# Altium schematic sheet STM32f103c8_minsystem V2_1.SchDoc
size A4; DrawnBy: 王星灿
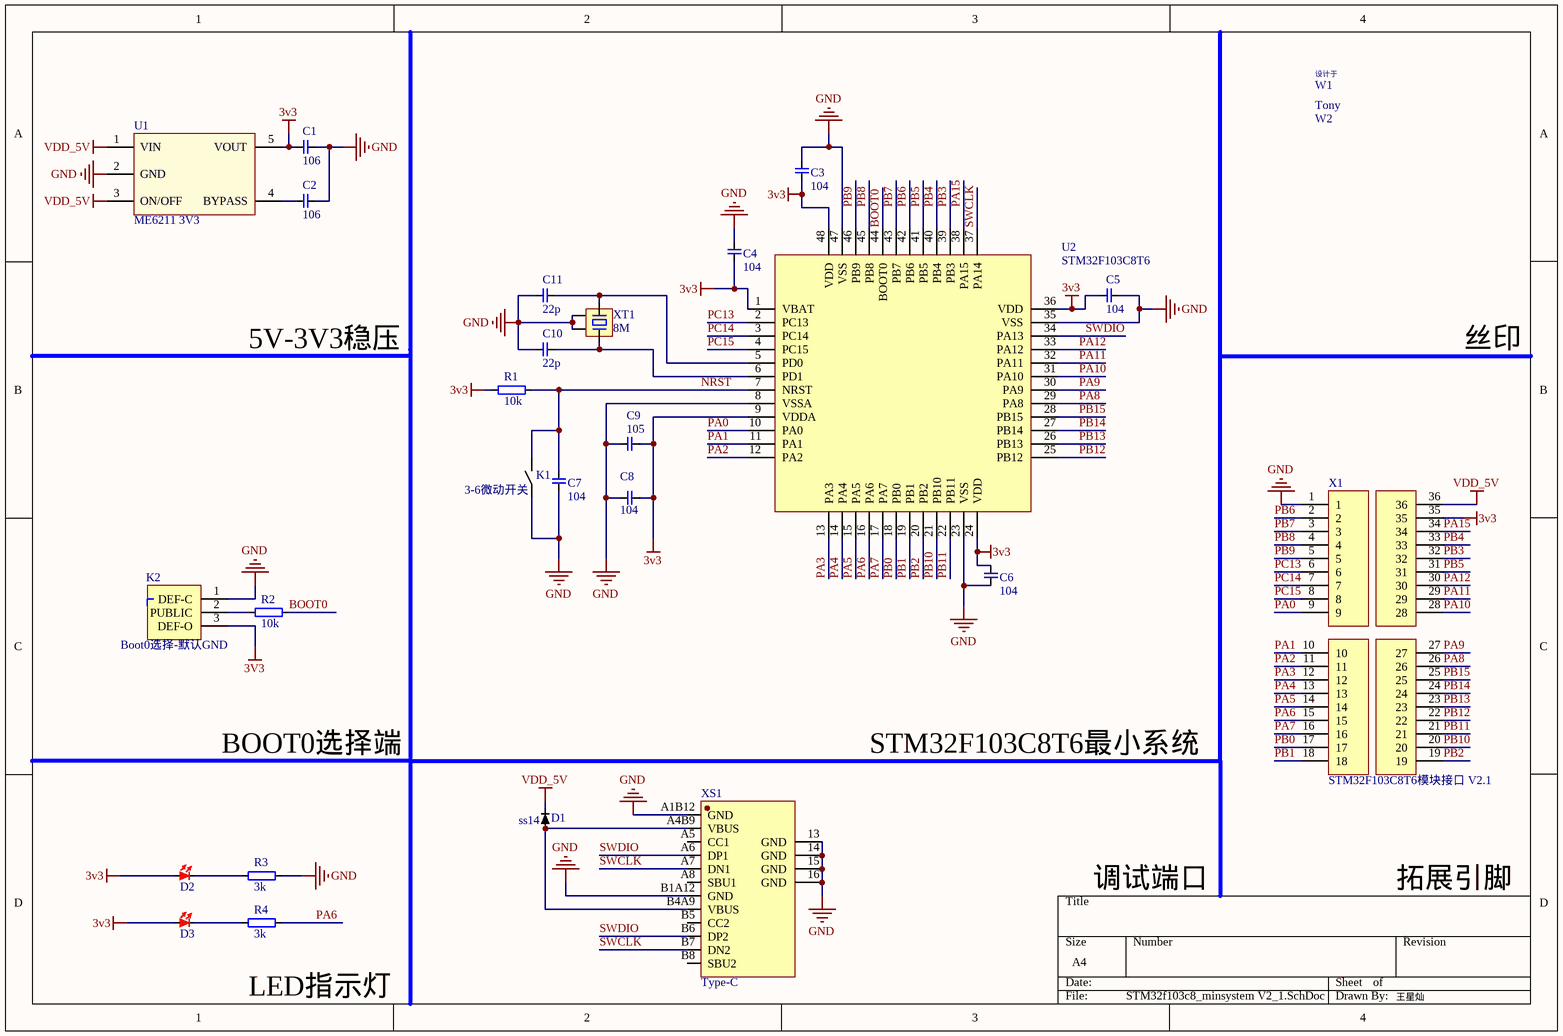
[diagram p0: STM32f103c8_minsystem V2_1.SchDoc]

## Parts
C1  106  [CAP_0603]
C2  106  [CAP_0603]
C3  104  [CAP_0603]
C4  104  [CAP_0603]
C5  104  [CAP_0603]
C6  104  [CAP_0603]
C7  104  [CAP_0603]
C8  104  [CAP_0603]
C9  105  [CAP_0603]
C10  22p  [CAP_0603]
C11  22p  [CAP_0603]
D1  ss14  [SOD-323]
D2  led  [led0603]  (value not drawn)
D3  led  [led0603]  (value not drawn)
K1  3-6微动开关  [3-6微动开关]
K2  Boot0选择-默认GND  [Switch 1-2 0603]
R1  10k  [RES_0603]
R2  10k  [RES_0603]
R3  3k  [RES_0603]
R4  3k  [RES_0603]
U1  ME6211 3V3  [SOT23-5]
U2  STM32F103C8T6  [LQFP48]
W1  设计于  [designed by（430-70）]  (value not drawn)
W2  Tony  [Tony_2(200-70)]  (value not drawn)
X1  STM32F103C8T6模块接口 V2.1  [STM32F103C8T6 V2_1引脚]
XS1  Type-C  [TypeC-304-16BCP]
XT1  8M  [SMD3225_4p]

## Nets
3v3: C1.2 C3.2 C4.1 C5.2 C6.2 C8.2 C9.2 D2.1 D3.1 K2.3(DEF-O) R1.1 U1.5(VOUT) U2.1(VBAT) U2.9(VDDA) U2.24(VDD) U2.36(VDD) U2.48(VDD) X1.35
GND: C1.1 C2.1 C3.1 C4.2 C5.1 C6.1 C7.2 C8.1 C9.1 C10.2 C11.2 K1.1 K2.1(DEF-C) R3.2 U1.2(GND) U2.8(VSSA) U2.23(VSS) U2.35(VSS) U2.47(VSS) X1.1 XS1.13(GND) XS1.14(GND) XS1.15(GND) XS1.16(GND) XS1.A1B12(GND) XS1.B1A12(GND) XT1.2(GND) XT1.4(GND)
VDD_5V: D1.2 U1.1(VIN) U1.3(ON/OFF) X1.36
BOOT0: R2.2 U2.44(BOOT0)
NRST: C7.1 K1.2 R1.2 U2.7(NRST)
PA0: U2.10(PA0) X1.9
PA1: U2.11(PA1) X1.10
PA2: U2.12(PA2) X1.11
PA3: U2.13(PA3) X1.12
PA4: U2.14(PA4) X1.13
PA5: U2.15(PA5) X1.14
PA6: R4.2 U2.16(PA6) X1.15
PA7: U2.17(PA7) X1.16
PA8: U2.29(PA8) X1.26
PA9: U2.30(PA9) X1.27
PA10: U2.31(PA10) X1.28
PA11: U2.32(PA11) X1.29
PA12: U2.33(PA12) X1.30
PA15: U2.38(PA15) X1.34
PB0: U2.18(PB0) X1.17
PB1: U2.19(PB1) X1.18
PB2: U2.20(PB2) X1.19
PB3: U2.39(PB3) X1.32
PB4: U2.40(PB4) X1.33
PB5: U2.41(PB5) X1.31
PB6: U2.42(PB6) X1.2
PB7: U2.43(PB7) X1.3
PB8: U2.45(PB8) X1.4
PB9: U2.46(PB9) X1.5
PB10: U2.21(PB10) X1.20
PB11: U2.22(PB11) X1.21
PB12: U2.25(PB12) X1.22
PB13: U2.26(PB13) X1.23
PB14: U2.27(PB14) X1.24
PB15: U2.28(PB15) X1.25
PC13: U2.2(PC13) X1.6
PC14: U2.3(PC14) X1.7
PC15: U2.4(PC15) X1.8
SWCLK: U2.37(PA14) XS1.A7(DN1) XS1.B7(DN2)
SWDIO: U2.34(PA13) XS1.A6(DP1) XS1.B6(DP2)
NetC2_2: C2.2 U1.4(BYPASS)
NetC10_1: C10.1 U2.6(PD1) XT1.3
NetC11_1: C11.1 U2.5(PD0) XT1.1
NetD1_1: D1.1 XS1.A4B9(VBUS) XS1.B4A9(VBUS)
NetD2_2: D2.2 R3.1
NetD3_2: D3.2 R4.1
NetK2_2: K2.2(PUBLIC) R2.1

Not connected (* = marked no-connect by the designer): XS1 A5(CC1) A8(SBU1) B5(CC2) B8(SBU2)

## Notes on the sheet
- 5V-3V3稳压
- 丝印
- BOOT0选择端
- STM32F103C8T6最小系统
- 调试端口
- 拓展引脚
- LED指示灯

## Library data of the parts
C1-C11 = cap
D1 = Diode
K1 = 3-6微动开关: 3*6mm
K2 = Switch 1-2: 单刀双掷1-2
R1-R4 = Res
U1 = ME6211: LDO
U2 = STM32F103C8T6-LCC
XS1 = Type-C母口
XT1 = XTAL-4P